# EAGLE design RetroVGA_20 (EAGLE 5.11)
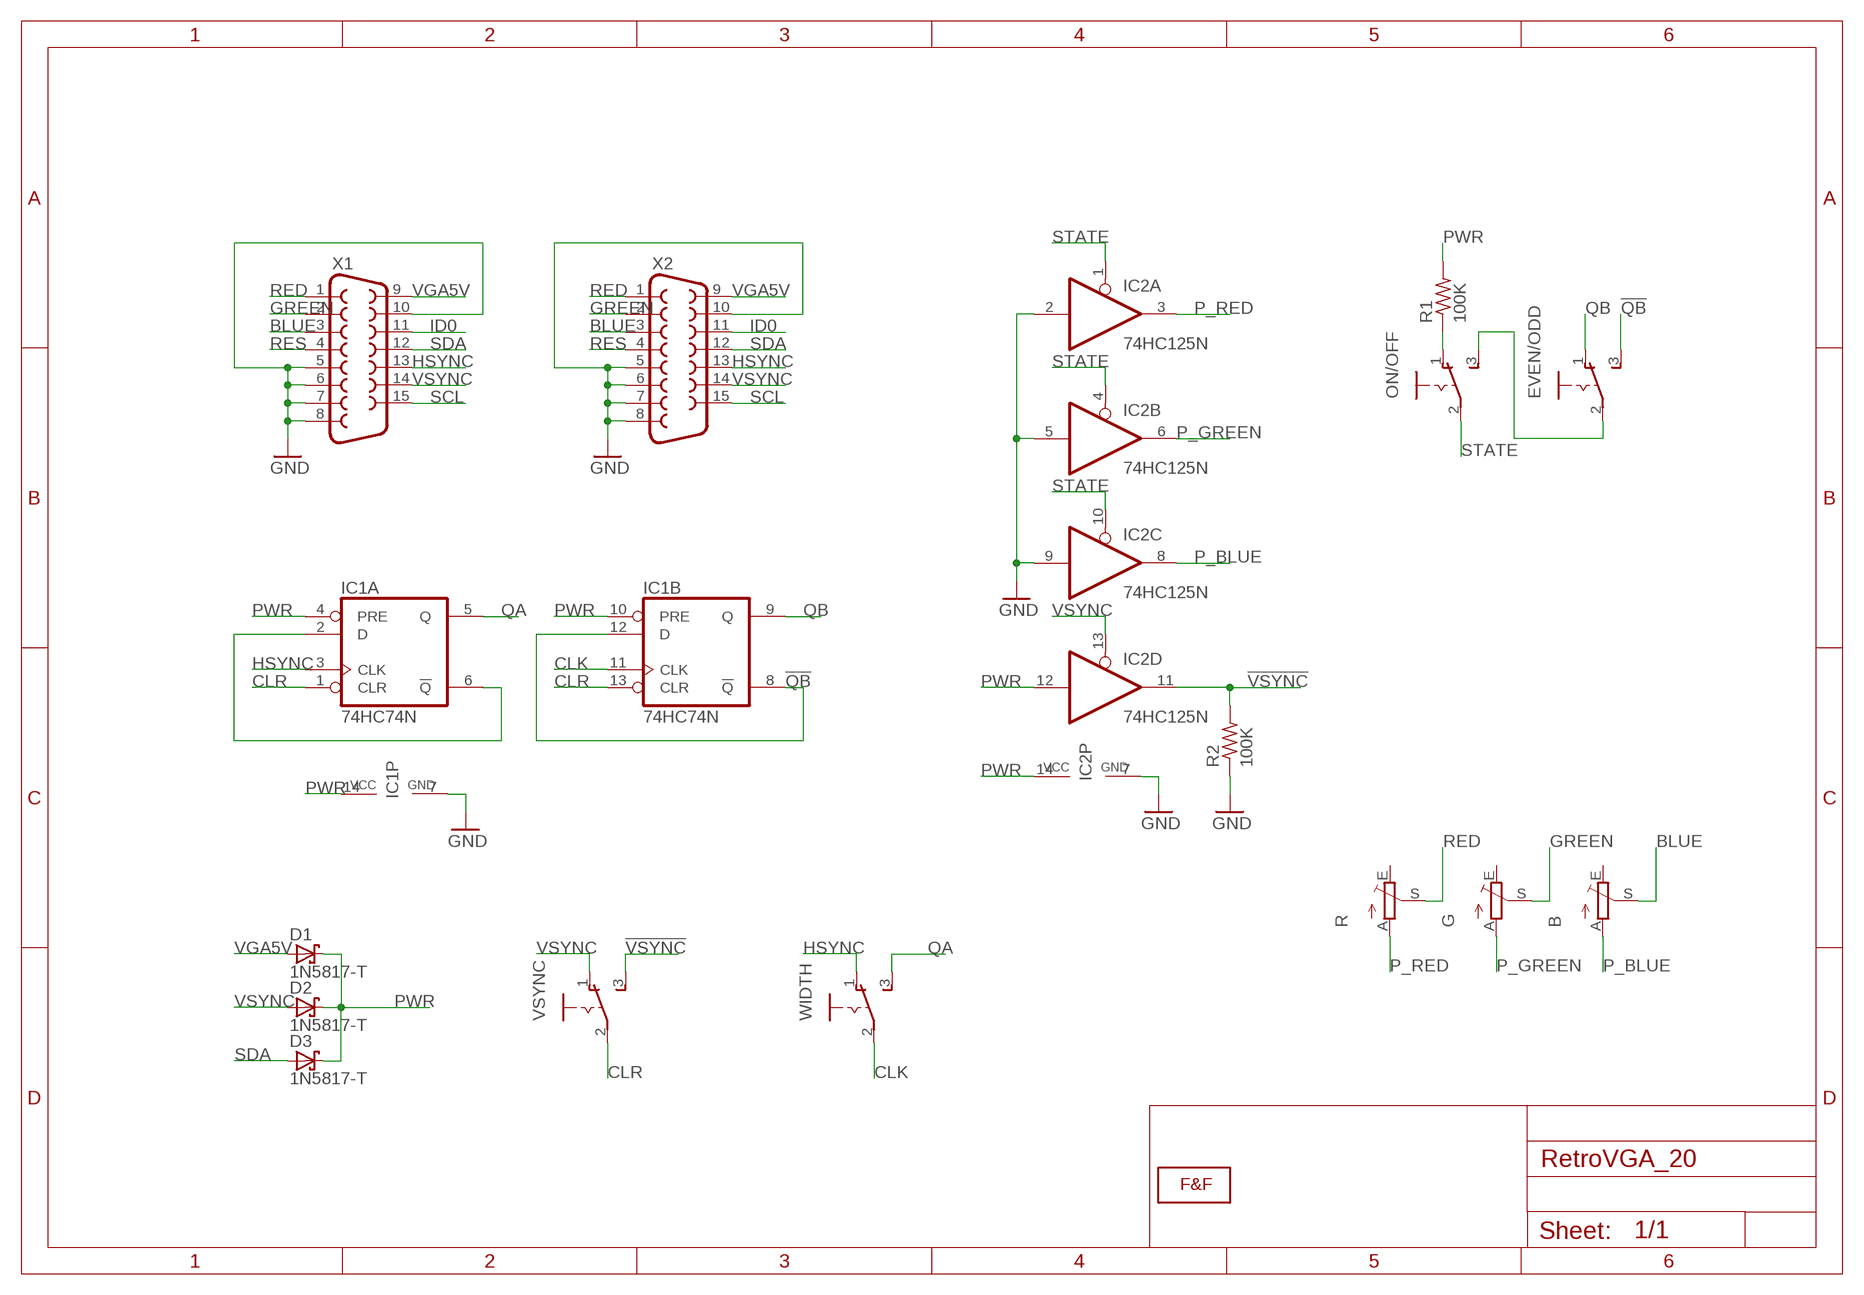
[diagram p0: schematic, sheet 1]

## Parts
B  TRIM_EU-CA6V  [CA6V]
D1  1N5817-T  [DO41-7.6]
D2  1N5817-T  [DO41-7.6]
D3  1N5817-T  [DO41-7.6]
EVEN/ODD  CHAVE  [CHAVE]
G  TRIM_EU-CA6V  [CA6V]
IC1  74HC74N  [DIL14]
IC2  74HC125N  [DIL14]
ON/OFF  CHAVE  [CHAVE]
R  TRIM_EU-CA6V  [CA6V]
R1  100K  R-US_0207/7  [0207/7]
R2  100K  R-US_0207/7  [0207/7]
U$1  LOGOLOGO_WITHOUT_SMOKE_SMALL  [LOGO2_SMALL]
VSYNC  CHAVE  [CHAVE]
WIDTH  CHAVE  [CHAVE]
X1  F15HDH  [HDF15H]
X2  F15HDH  [HDF15H]

## Nets
!QB: EVEN/ODD.3(S) IC1.8(B:!Q) IC1.12(B:D)
!VSYNC: IC2.11(D:O) R2.2 VSYNC.3(S)
BLUE: B.S X1.3 X2.3
CLK: IC1.11(B:CLK) WIDTH.2(P)
CLR: IC1.1(A:CLR) IC1.13(B:CLR) VSYNC.2(P)
GND: IC1.7(P:GND) IC2.2(A:I) IC2.5(B:I) IC2.7(P:GND) IC2.9(C:I) R2.1 X1.5 X1.6 X1.7 X1.8 X1.10 X2.5 X2.6 X2.7 X2.8 X2.10
GREEN: G.S X1.2 X2.2
HSYNC: IC1.3(A:CLK) WIDTH.1(O) X1.13 X2.13
ID0: X1.11 X2.11
N$1: IC1.2(A:D) IC1.6(A:!Q)
N$2: EVEN/ODD.2(P) ON/OFF.3(S)
N$3: ON/OFF.1(O) R1.1
P_BLUE: B.A IC2.8(C:O)
P_GREEN: G.A IC2.6(B:O)
P_RED: IC2.3(A:O) R.A
PWR: D1.C D2.C D3.C IC1.4(A:PRE) IC1.10(B:PRE) IC1.14(P:VCC) IC2.12(D:I) IC2.14(P:VCC) R1.2
QA: IC1.5(A:Q) WIDTH.3(S)
QB: EVEN/ODD.1(O) IC1.9(B:Q)
RED: R.S X1.1 X2.1
RES: X1.4 X2.4
SCL: X1.15 X2.15
SDA: D3.A X1.12 X2.12
STATE: IC2.1(A:OE) IC2.4(B:OE) IC2.10(C:OE) ON/OFF.2(P)
VGA5V: D1.A X1.9 X2.9
VSYNC: D2.A IC2.13(D:OE) VSYNC.1(O) X1.14 X2.14
Unconnected: B.E G.E R.E

## Library data of the parts
B G R = pot:TRIM_EU-: POTENTIOMETER
D1-D3 = diode:1N581*: 1.0A SCHOTTKY BARRIER RECTIFIER Source: http://www.diodes.com/datasheets/ds23001.pdf
EVEN/ODD ON/OFF VSYNC WIDTH = switch-fef:CHAVE: chave Verificar
IC1 = 74xx-eu:74*74: Dual D type positive edge triggered FLIP FLOP, preset and clear
IC2 = 74xx-eu:74*125: Quad bus BUFFER, 3-state
R1 R2 = rcl:R-US_: RESISTOR, American symbol
U$1 = F&F:LOGO: Faísca e Fumaça Logo faiscaefumaca.com.br
X1 X2 = adafruit:F15: SUB-D HDH is also known as a 'right angle VGA' connector

## Board
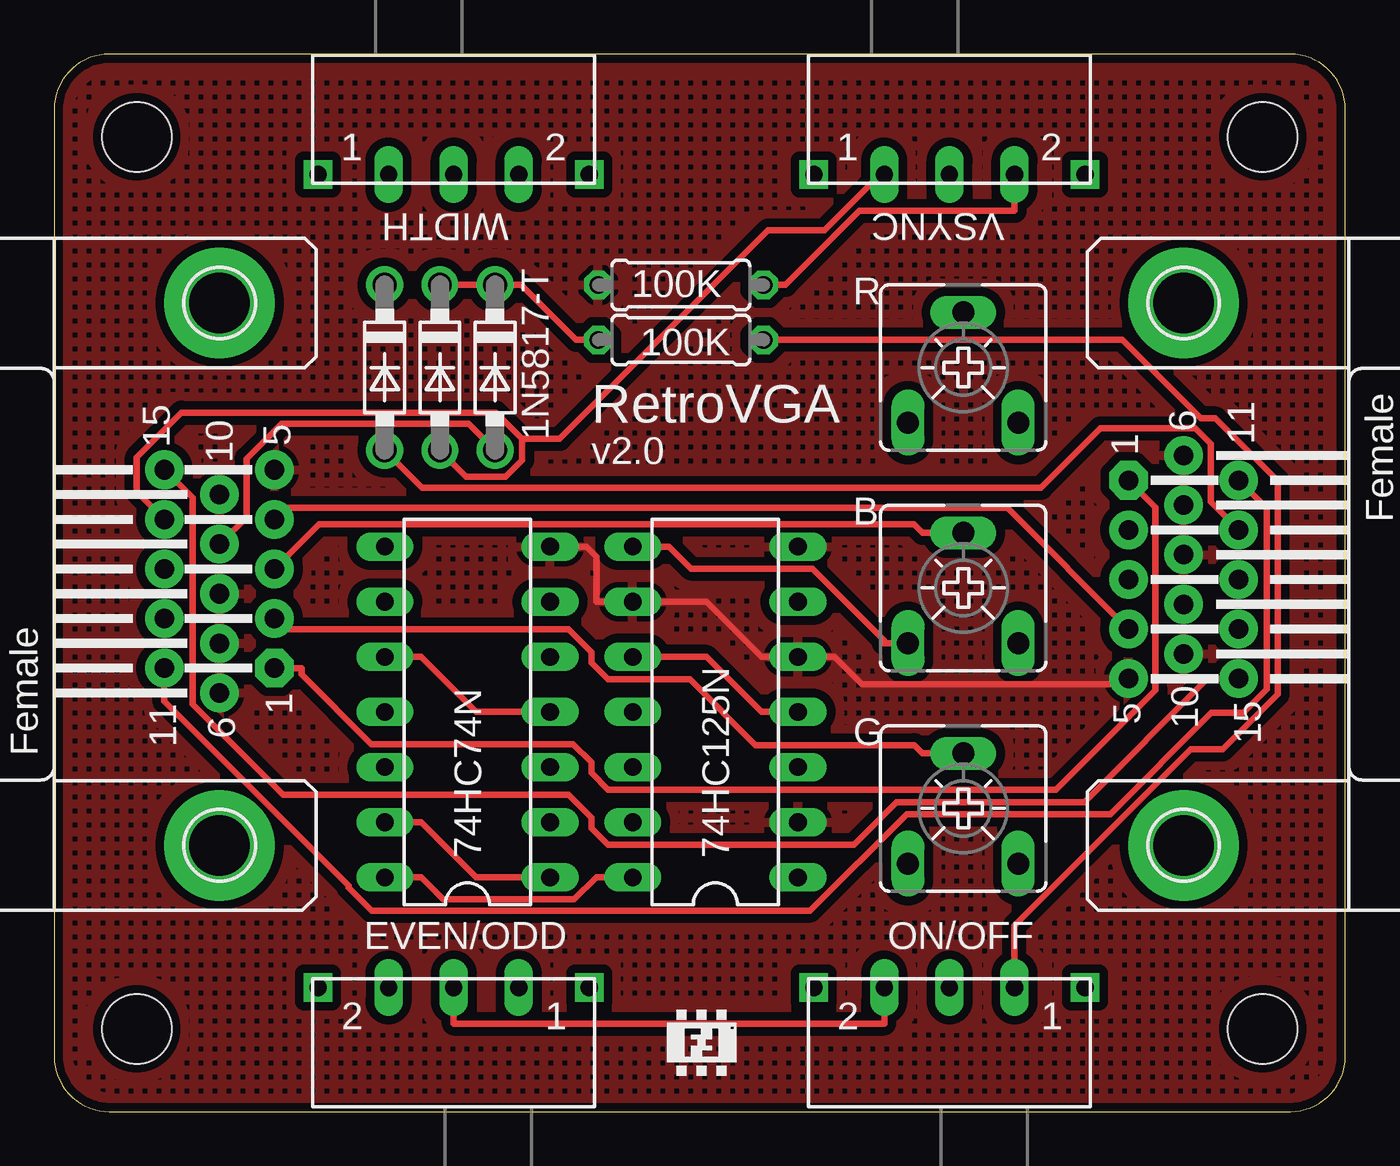
[diagram p1: board, top side]
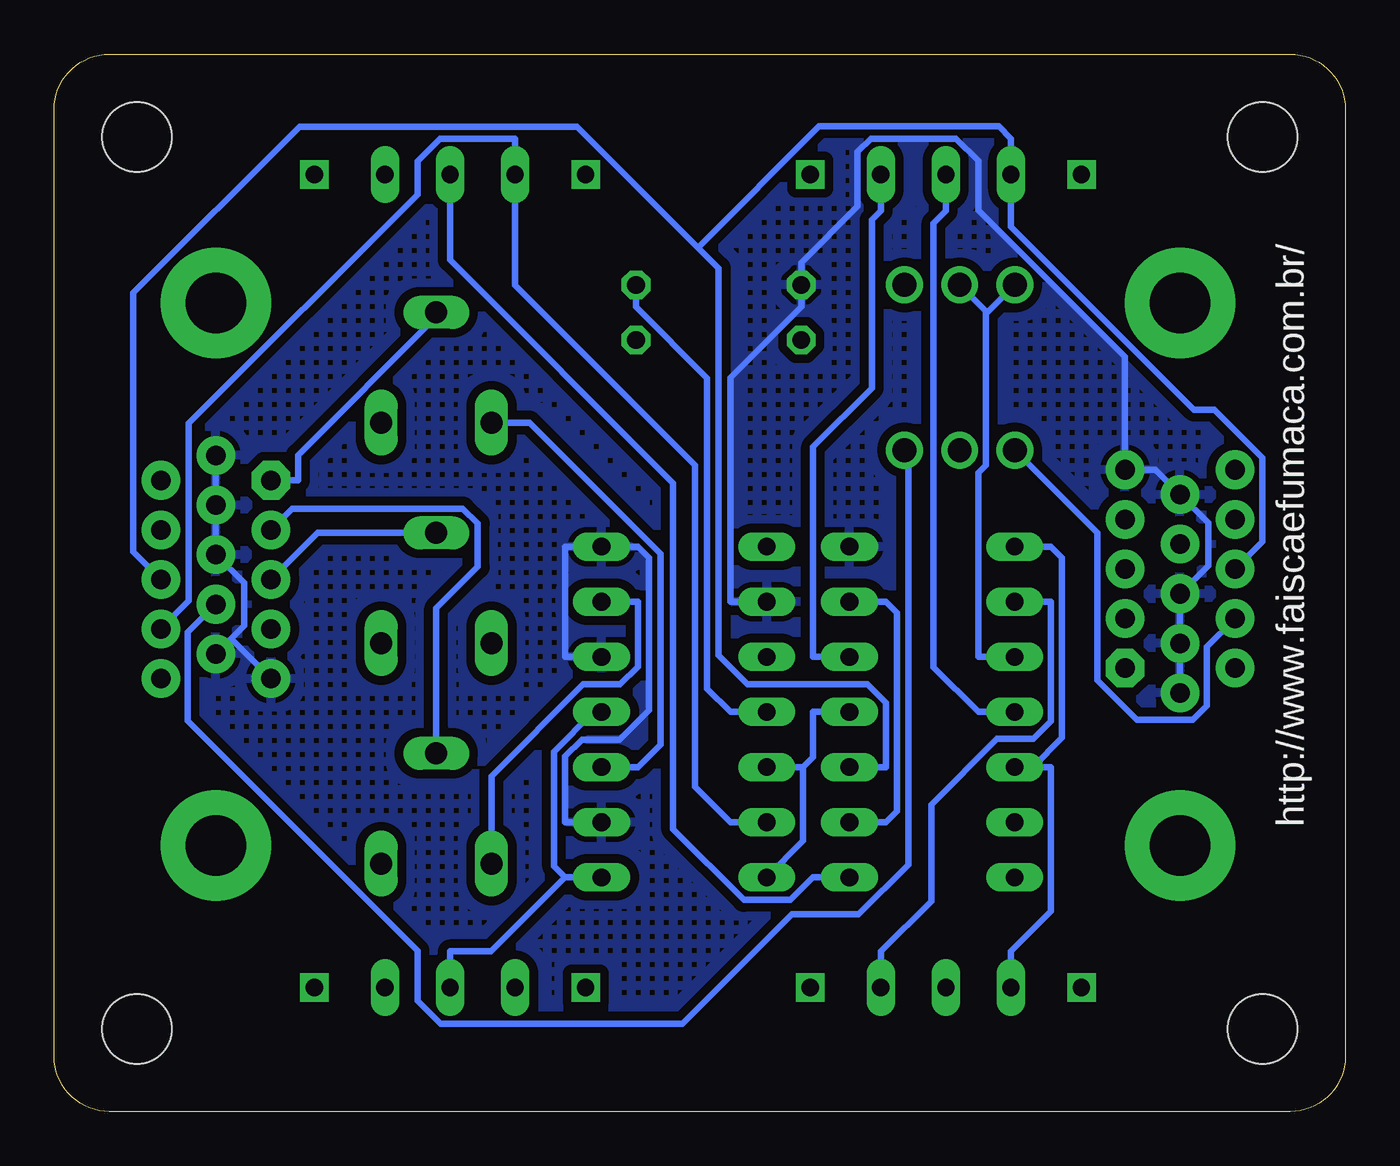
[diagram p2: board, bottom side, seen from below]

Size 59.52 x 48.73 mm. Coordinates in mm from the lower left corner, seen from the top.
Outline: 2.54,48.73 arc90 0,46.19 0,2.54 arc90 2.54,0 56.98,0 arc90 59.52,2.54 59.52,46.19 arc90 56.98,48.73 2.54,48.73
Copper layers (1*16): Top 0.035mm / dielectric 1.5mm / Bottom 0.035mm
Design rules "ITead_rule": minimum track width 6mil, minimum drill 12mil, track to track 6mil, track to pad 6mil, pad to pad 6mil, via to via 6mil, smd to smd 0mil, copper to edge 10mil, drill to drill 10mil, minimum pad ring 10mil, minimum via ring 6mil, stop-mask expansion 2mil, vias tented up to drill 100mil, thermal gap 10mil
Holes 3.2 mm at 3.81,44.92 3.81,3.81 55.72,3.81 55.72,44.92

### Footprints (pad centres in the part's own frame; a part is rotated, then mirrored left to right if it is on the bottom)
CA6V = drill 1.016 long: A -2.54,-2.54; E 2.54,-2.54; S 0,2.54
DO41-7.6 = drill 1.1 pad 1.7 round: A 3.81,0; C -3.81,0
CHAVE = drill 0.8 long: 1 -3,0; 2 0,0; 3 3,0 | drill 0.8 square: P$1 -6.25,0; P$2 6.25,0
DIL14 = drill 0.813 long: 1 -7.62,-3.81; 2 -5.08,-3.81; 3 -2.54,-3.81; 4 0,-3.81; 5 2.54,-3.81; 6 5.08,-3.81; 7 7.62,-3.81; 8 7.62,3.81; 9 5.08,3.81; 10 2.54,3.81; 11 0,3.81; 12 -2.54,3.81; 13 -5.08,3.81; 14 -7.62,3.81
0207/7 = drill 0.813 octagon: 1 -3.81,0; 2 3.81,0
HDF15H = drill 0.9 pad 1.778 octagon: 1 4.329,2.54 | drill 0.9 pad 1.778 round: 2 2.043,2.54; 3 -0.243,2.54; 4 -2.529,2.54; 5 -4.815,2.54; 6 5.472,0; 7 3.186,0; 8 0.9,0; 9 -1.386,0; 10 -3.672,0; 11 4.329,-2.54; 12 2.043,-2.54; 13 -0.243,-2.54; 14 -2.529,-2.54; 15 -4.815,-2.54 | drill 2.8 pad 5.08 round: P$1 -12.5,0; P$2 12.5,0

### Placement (x,y rotation side)
B  41.91,24.13 0 top
D1  20.32,34.29 270 top
D2  17.78,34.29 270 top
D3  15.24,34.29 270 top
EVEN/ODD  18.41,5.71 180 top
G  41.91,13.97 0 top
IC1  19.05,18.41 90 top
IC2  30.48,18.41 90 top
ON/OFF  41.27,5.71 180 top
R  41.91,34.29 0 top
R1  28.89,35.56 180 top
R2  28.89,38.1 0 top
U$1  29.84,3.17 0 top
VSYNC  41.27,43.18 0 top
WIDTH  18.41,43.18 0 top
X1  7.62,24.77 270 top
X2  52.07,24.77 90 top

### Tracks (layer width: path | path; a pad name or v marks a point on that pad's centre or on a via)
!QB
  Bottom 0.305: 14.4,15.88 13.05,17.22 13.05,25.53 13.56,26.04 IC1.8 | 14.4,15.88 13.56,15.88 13.56,9.23 15.41,7.38 EVEN/ODD.3 | 14.4,15.88 IC1.12
!VSYNC
  Top 0.305: R2.2 33.72,38.1 37.13,41.52 44.27,41.52 VSYNC.3
  Bottom 0.305: IC2.11 28.35,18.41 29.42,19.49 29.42,33.81 32.7,37.08 R2.2
BLUE
  Top 0.305: B.S 40.03,26.67 39.63,27.07 12.22,27.07 X1.3
  Bottom 0.305: B.S 47.38,26.67 X2.3
CLK
  Bottom 0.305: IC1.11 16.92,18.41 18.99,20.48 18.99,40.95 18.41,41.52 WIDTH.2
CLR
  Top 0.305: IC1.1 19.46,10.79 16.92,13.34 IC1.13
  Bottom 0.305: VSYNC.2 41.27,39.26 30.99,28.97 30.99,13.02 27.73,9.75 25.58,9.75 24.54,10.79 IC1.1
GND
  Top 0.305: IC1.7 24.54,26.04 24.99,25.58 24.99,23.5 IC2.9 30.07,23.5 32.61,20.95 IC2.5 35.97,20.95 37.23,19.69 49.27,19.69 X2.5
  Bottom 0.305: 51.37,21.79 X2.10 | 51.37,21.79 50.77,22.39 50.77,24.37 X2.8 X2.7 X2.6 | X2.5 51.37,21.79 | IC2.9 28.35,23.5 28.35,33.82 25.08,37.08 R2.1 25.08,39.12 22.48,41.72 22.48,44.23 21.87,44.84 17.94,44.84 16.91,43.81 16.91,41.54 10.16,34.79 X1.5 8.76,29.58 X1.10 6.33,27.14 6.33,25.16 X1.8 X1.7 X1.6 | IC2.2 35.97,13.34 35.97,16.38 35.2,17.14 33.45,17.14 32.09,18.5 32.09,25.52 32.61,26.04 IC2.7 35.97,26.04 35.97,20.95 IC2.5
  pour Bottom (isolate 0.406, hatched): 0,48.26 59.69,48.26 59.69,0 0,0
  pour Top (isolate 0.406, hatched): 0,48.26 59.69,48.26 59.69,0 0,0
GREEN
  Top 0.305: G.S 40.03,16.51 39.65,16.89 32.33,16.89 29.31,19.91 25.54,19.91 24.77,20.69 24.77,21.17 23.71,22.23 10.66,22.23 X1.2
  Bottom 0.305: X2.2 48.55,27.79 40.69,27.79 40,27.11 40,25.1 41.91,23.2 41.91,17.63 | 41.91,17.63 | G.S 41.91,17.63
HSYNC
  Bottom 0.305: 29.84,39.82 28.89,38.88 28.89,21.02 27.55,19.68 22.03,19.68 21.18,18.84 21.18,15.88 IC1.3 | X2.13 55.88,25.79 55.88,37.73 48.21,45.4 35.42,45.4 29.84,39.82 | 29.84,39.82 24.26,45.4 15.97,45.4 15.41,44.84 WIDTH.1 15.41,40.78 6.98,32.35 6.04,32.35 3.83,30.13 3.83,26.26 X1.13
ID0
  Top 0.305: X2.11 55.9,27.81 55.9,19.45 54.81,18.37 53.35,18.37 48.69,13.71 39.31,13.71 34.85,9.26 14.63,9.26 13.56,10.32 13.56,10.42 5.08,18.9 X1.11
N$1
  Bottom 0.305: IC1.2 21.18,13.34 20.68,13.84 20.68,22.99 21.18,23.5 IC1.6
N$2
  Top 0.305: EVEN/ODD.2 18.41,4.05 38.27,4.05 ON/OFF.3
N$3
  Top 0.305: R1.1 49.25,35.56 52.87,31.94 53.54,31.94 56.41,29.08 56.41,19.23 53.87,16.69 52.4,16.69 44.27,8.56 ON/OFF.1
P_BLUE
  Top 0.305: B.A 38.25,21.59 38.25,21.73 34.96,25.02 29.36,25.02 28.35,26.04 IC2.8
P_GREEN
  Bottom 0.305: IC2.6 32.61,23.5 32.61,20.51 33.44,19.68 35.14,19.68 39.37,15.46 G.A
P_RED
  Bottom 0.305: IC2.3 32.61,15.88 31.57,16.91 31.57,25.71 37.61,31.75 R.A
PWR
  Top 0.305: IC1.14 16.92,10.79 17.93,9.78 23.98,9.78 24.99,10.79 IC2.14 | D2.C D1.C 21.53,38.1 24.07,35.56 R1.2 | IC1.10 16.92,20.95 19.46,18.41 IC1.4
  Bottom 0.305: 16.56,36.88 D2.C | 16.56,36.88 16.56,29.8 16.92,29.44 16.92,20.95 IC1.10 | 16.56,36.88 16.46,36.88 D3.C | IC2.14 24.99,12.47 24.99,15.88 | 24.99,15.88 IC2.12 | IC1.4 24.54,18.41 24.54,16.33 24.99,15.88
QA
  Bottom 0.305: IC1.5 24.54,20.95 24.54,30.64 21.83,33.34 21.83,41.1 21.41,41.52 WIDTH.3
QB
  Bottom 0.305: EVEN/ODD.1 21.41,7.38 19.09,9.7 19.09,14.14 16.06,17.18 14.38,17.18 13.56,17.99 13.56,23.5 IC1.9
RED
  Top 0.305: X1.1 11.4,20.44 11.4,20.15 14.61,16.94 23.91,16.94 24.77,16.09 24.77,15.61 25.54,14.83 46.19,14.83 50.77,19.42 50.77,27.85 X2.1
  Bottom 0.305: X2.1 48.28,29.09 48.28,30.26 41.99,36.55 41.91,36.55 R.S
RES
  Top 0.305: X2.4 43.95,27.82 10.69,27.82 X1.4
SCL
  Top 0.305: X2.15 53.17,19.95 47.49,14.26 38.84,14.26 36.86,12.29 25.54,12.29 24.77,13.07 24.77,13.55 23.71,14.61 10.55,14.61 6.38,18.78 6.38,28.29 X1.15
SDA
  Top 0.305: X2.12 53.31,28.1 53.31,30.78 52.61,31.48 48.23,31.48 45.5,28.75 16.97,28.75 D3.A
  Bottom 0.305: D3.A 11.44,26.68 11.44,19.88 9.61,18.05 7.03,18.05 6.38,18.7 6.38,21.43 X1.12
STATE
  Top 0.305: IC2.4 32.61,18.41 30.07,20.95 IC2.10
  Bottom 0.305: ON/OFF.2 41.27,7.38 39.38,7.38 35.97,10.79 | 35.97,10.79 36.48,11.3 36.48,16.59 34.65,18.41 IC2.4 | IC2.1 35.97,10.79
VGA5V
  Top 0.305: D1.A 19.1,31.7 10.48,31.7 8.87,30.09 8.87,27.4 X1.9
  Bottom 0.305: X2.9 53.37,22.08 53.37,18 42.77,7.41 42.77,5.12 41.7,4.04 30.57,4.04 25.52,9.1 22.44,9.1 20.15,11.39 20.15,30.31 D1.A
VSYNC
  Top 0.305: 21.58,31 21.58,30.02 20.82,29.27 18.99,29.27 D2.A | X1.14 3.8,28.57 3.8,30.16 5.86,32.21 20.36,32.21 21.58,31 | VSYNC.1 38.08,43.18 35.51,40.61 32.92,40.61 23.31,31 21.58,31
  Bottom 0.305: X2.14 53.31,23.53 53.31,31.72 42.77,42.26 42.77,43.8 41.73,44.84 38.27,44.84 VSYNC.1 38.27,38.08 29.97,29.78 29.97,14.96 28.35,13.34 IC2.13

### Text on the board
tPlace: RetroVGA | v2.0
bPlace: http://www.faiscaefumaca.com.br/